# EAGLE design Simple-Bug-2SC9014 (EAGLE 7.6.0)
Simple FM Transmitter with Electret Microphone, based on NPN Transistor
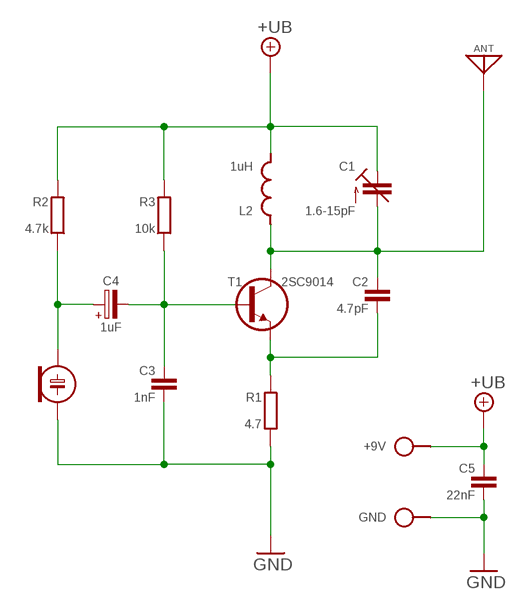
[diagram p0: schematic, sheet 1]

## Parts
+9V  SPAD  [SPAD]
ANT  ANT  [SPAD]
C1  1.6-15pF  C-TR-PH20127  [TRIM-2222-808]
C2  4.7pF  C050-020X036  [C050-020X036]
C3  1nF  C050-020X036/V  [C050-020X036/V]
C4  1uF  CPOLE2,5-3/V  [E2,5-3/V]
C5  22nF  C050-020X036/V  [C050-020X036/V]
ECM  ECM-4  [ECM-4]
GND  SPAD  [SPAD]
L2  1uH  L-SHORTL-04/7V  [L-04/7V]
R1  4.7  R0204/2V  [0204/2V]
R2  4.7k  R0204/7-V  [0204/7-V]
R3  10k  R0204/7-V  [0204/7-V]
T1  2SC9014  [TO92-EBC]

## Nets
+UB: +9V.1 C1.1(E) C1.3(E) C5.1 L2.2 R2.1 R3.1
GND: C3.2 C5.2 ECM.2(-) GND.1 R1.2
N$2: ANT.1 C1.2(A) C2.1 L2.1 T1.C
N$3: C2.2 R1.1 T1.E
N$5: C3.1 C4.- R3.2 T1.B
N$6: C4.+ ECM.1(+) R2.2

## Library data of the parts
+9V GND = pad:SPAD
ANT = pad:ANT
C1 = cap-trim:C-TR-PH20127
C2 C3 C5 = c:C: CAPACITOR, European symbol
C4 = c:CPOL: POLARIZED CAPACITOR, European symbol
ECM = ECM:ECM
L2 = l:L-SHORT
R1-R3 = r:R: RESISTOR, European symbol
T1 = t:2SC9014

## Net classes
0 default: width 0.61 mm

## Board
Simple FM Transmitter with Electret Microphone, based on NPN Transistor
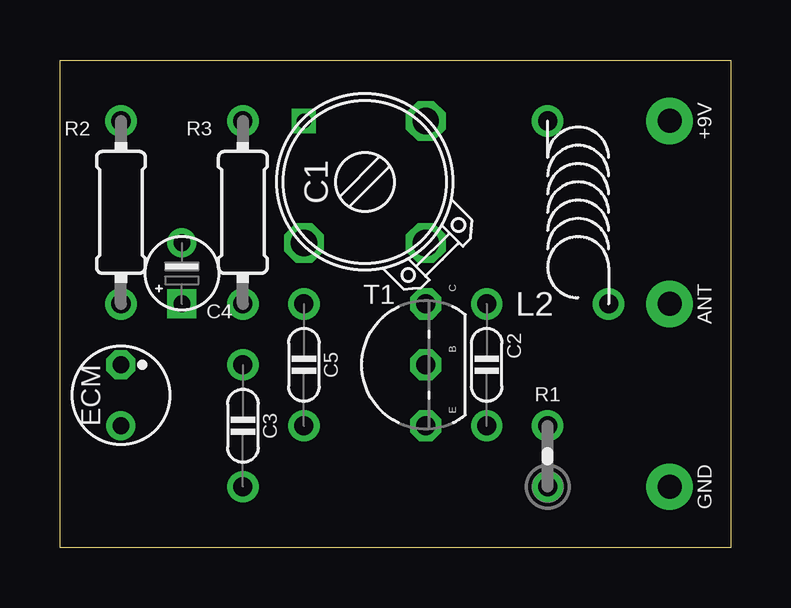
[diagram p1: board, top side]
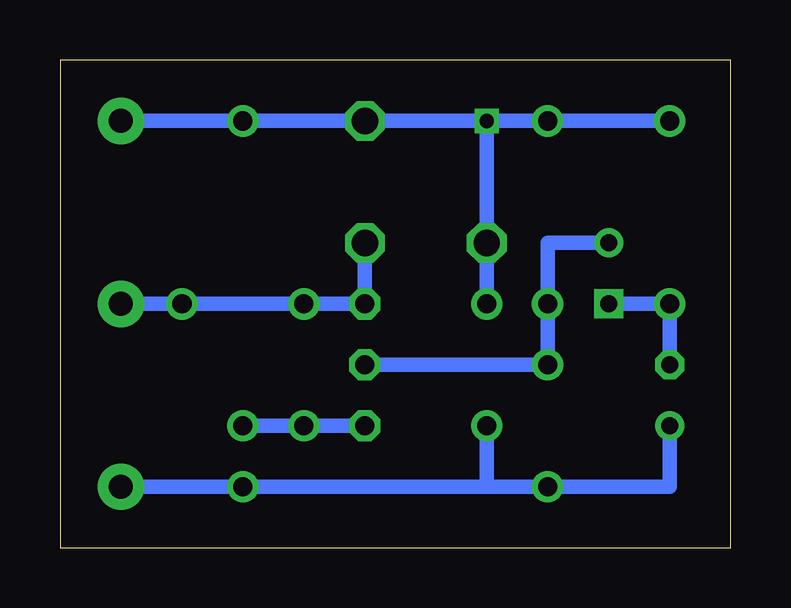
[diagram p2: board, bottom side, seen from below]

Size 27.94 x 20.32 mm. Coordinates in mm from the lower left corner, seen from the top.
Outline: 27.94,0 0,0 0,20.32 27.94,20.32 27.94,0
Copper layers (1*16): Top 0.035mm / dielectric 1.5mm / Bottom 0.035mm
Design rules "default": minimum track width 10mil, minimum drill 24mil, track to track 8mil, track to pad 8mil, pad to pad 8mil, via to via 8mil, smd to smd 8mil, copper to edge 40mil, drill to drill 8mil, minimum pad ring 10mil, minimum via ring 8mil, stop-mask expansion 4mil, vias tented up to drill 0mil, thermal gap 10mil

### Footprints (pad centres in the part's own frame; a part is rotated, then mirrored left to right if it is on the bottom)
SPAD = drill 1 pad 1.93: 1 0,0
TRIM-2222-808 = drill 1.1 octagon: 1 -2.54,2.54; 2 -2.54,-2.54; 3 2.54,-2.54
C050-020X036 = drill 0.8: 1 -2.54,0; 2 2.54,0
C050-020X036/V = drill 0.8: 1 0,-2.54; 2 0,2.54
E2,5-3/V = drill 0.7 square: + 0,1.27 | drill 0.7: - 0,-1.27
ECM-4 = drill 0.7 pad 1.2 octagon: 1 0,1.27 | drill 0.7 pad 1.2: 2 0,-1.27
L-04/7V = drill 0.8: 1 1.27,-5.08; 2 -1.27,2.54
0204/2V = drill 0.8: 1 0,1.27; 2 0,-1.27
0204/7-V = drill 0.8: 1 0,3.81; 2 0,-3.81
TO92-EBC = drill 0.8 octagon: B 0,0; C 0,2.54; E 0,-2.54

### Placement (x,y rotation side)
+9V  25.4,17.78 180 top
ANT  25.4,10.16 180 top
C1  12.7,15.24 90 top
C2  17.78,7.62 270 top
C3  7.62,5.08 180 top
C4  5.08,11.43 180 top
C5  10.16,7.62 180 top
ECM  2.54,6.35 0 top
GND  25.4,2.54 180 top
L2  21.59,15.24 0 top
R1  20.32,3.81 0 top
R2  2.54,13.97 0 top
R3  7.62,13.97 0 top
T1  15.24,7.62 0 top

### Tracks (layer width: path | path; a pad name or v marks a point on that pad's centre or on a via)
+UB  (via drill 0.6)
  Bottom 0.61: v10.16,17.78 C1.1 C5.1 | v10.16,17.78 R3.1 R2.1 | v10.16,17.78 C1.3 L2.2 +9V.1
GND
  Bottom 0.61: 10.16,2.54 GND.1 R1.2 | 10.16,2.54 C3.2 2.54,2.54 ECM.2 | C5.2 10.16,2.54
N$2
  Bottom 0.61: C1.2 T1.C C2.1 L2.1 ANT.1
N$3
  Bottom 0.61: T1.E C2.2 R1.1
N$5
  Bottom 0.61: T1.B C3.1 R3.2 7.62,12.7 C4.-
N$6
  Bottom 0.61: ECM.1 R2.2 C4.+